# EAGLE design busfahrer_pi (EAGLE 6.4)
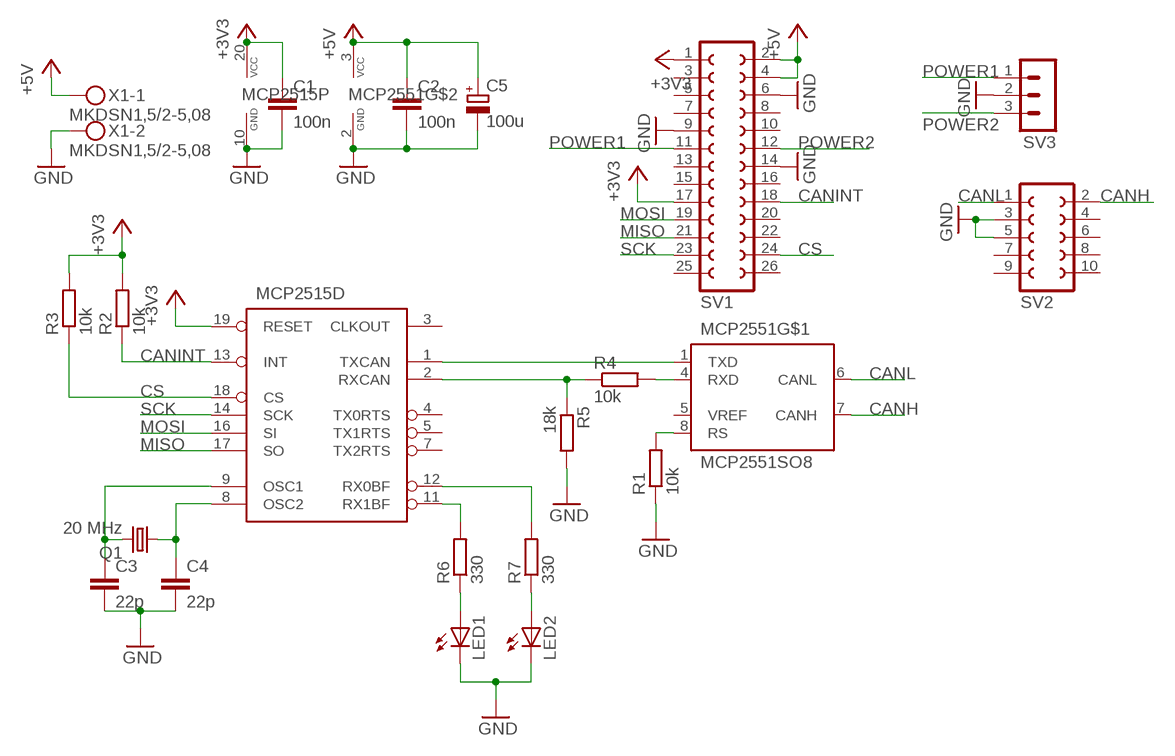
[diagram p0: schematic, sheet 1]

## Parts
C1  100n  C-EUC0805  [C0805]
C2  100n  C-EUC0805  [C0805]
C3  22p  C-EUC0805  [C0805]
C4  22p  C-EUC0805  [C0805]
C5  100u  CPOL-EUE2.5-6  [E2,5-6]
LED1  LEDCHIP-LED0805  [CHIP-LED0805]
LED2  LEDCHIP-LED0805  [CHIP-LED0805]
MCP2515  MCP2515ST  [TSSOP20]
MCP2551  MCP2551SO8  [SO08]
Q1  20 MHz  CRYSTALHC49S  [HC49/S]
R1  10k  R-EU_R0805  [R0805]
R2  10k  R-EU_R0805  [R0805]
R3  10k  R-EU_R0805  [R0805]
R4  10k  R-EU_R0805  [R0805]
R5  18k  R-EU_R0805  [R0805]
R6  330  R-EU_R0805  [R0805]
R7  330  R-EU_R0805  [R0805]
SV1  FE13-2  [FE13-2]
SV2  FE05-2  [FE05-2]
SV3  MA03-1  [MA03-1]
X1  MKDSN1,5/2-5,08  [MKDSN1,5/2-5,08]

## Nets
+3V3: C1.1 MCP2515.19(D:RESET) MCP2515.20(P:VCC) R2.2 R3.2 SV1.1 SV1.17
+5V: C2.1 C5.+ MCP2551.3(VCC) SV1.2 SV1.4 X1.1
CANH: MCP2551.7(CANH) SV2.2
CANINT: MCP2515.13(D:INT) R2.1 SV1.18
CANL: MCP2551.6(CANL) SV2.1
CS: MCP2515.18(D:CS) R3.1 SV1.24
GND: C1.2 C2.2 C3.2 C4.2 C5.- LED1.C LED2.C MCP2515.10(P:GND) MCP2551.2(GND) R1.1 R5.2 SV1.6 SV1.9 SV1.14 SV2.3 SV2.5 SV3.2 X1.2
MISO: MCP2515.17(D:SO) SV1.21
MOSI: MCP2515.16(D:SI) SV1.19
N$1: MCP2551.8(RS) R1.2
N$2: MCP2515.11(D:RX1BF) R6.2
N$3: C4.1 MCP2515.8(D:OSC2) Q1.1
N$4: C3.1 MCP2515.9(D:OSC1) Q1.2
N$8: MCP2515.12(D:RX0BF) R7.2
N$9: LED2.A R7.1
N$10: LED1.A R6.1
POWER1: SV1.11 SV3.1
POWER2: SV1.12 SV3.3
RXCAN: MCP2515.2(D:RXCAN) R4.1 R5.1
RXCAN_5V: MCP2551.4(RXD) R4.2
SCK: MCP2515.14(D:SCK) SV1.23
TXCAN: MCP2515.1(D:TXCAN) MCP2551.1(TXD)
Unconnected: MCP2515.3(D:CLKOUT) MCP2515.4(D:TX0RTS) MCP2515.5(D:TX1RTS) MCP2515.7(D:TX2RTS) MCP2551.5(VREF) SV1.3 SV1.5 SV1.7 SV1.8 SV1.10 SV1.13 SV1.15 SV1.16 SV1.20 SV1.22 SV1.25 SV1.26 SV2.4 SV2.6 SV2.7 SV2.8 SV2.9 SV2.10

## Library data of the parts
C1-C4 = rcl:C-EU: CAPACITOR, European symbol
C5 = rcl:CPOL-EU: POLARIZED CAPACITOR, European symbol
LED1 LED2 = led:LED: LED OSRAM: - CHIPLED LG R971, LG N971, LY N971, LG Q971, LY Q971, LO R971, LY R971 LH N974, LH R974 LS Q976, LO Q976, LY Q976 LO Q996 - Hyper CHIPLED LW Q18S LB Q993, LB Q99A, LB R99A - SideLED LS A670, LO A670, LY A670, LG A670, LP A670 LB A673, LV A673, LT A673, LW A673 LH A674 LY A675 LS A676, LA A676, LO A676, LY A676, LW A676 LS A679, LY A679, LG A679 - Hyper Micro SIDELED® LS Y876, LA Y876, LO Y876, LY Y876 LT Y87S - SmartLED LW L88C, LW L88S LB L89C, LB L89S, LG L890 LS L89K, LO L89K, LY L89K LS L896, LA L896, LO L896, LY L896 - TOPLED LS T670, LO T670, LY T670, LG T670, LP T670 LSG T670, LSP T670, LSY T670, LOP T670, LYG T670 LG T671, LOG T671, LSG T671 LB T673, LV T673, LT T673, LW T673 LH T674 LS T676, LA T676, LO T676, LY T676, LB T676, LH T676, LSB T676, LW T676 LB T67C, LV T67C, LT T67C, LS T67K, LO T67K, LY T67K, LW E67C LS E67B, LA E67B, LO E67B, LY E67B, LB E67C, LV E67C, LT E67C LW T67C LS T679, LY T679, LG T679 LS T770, LO T770, LY T770, LG T770, LP T770 LB T773, LV T773, LT T773, LW T773 LH T774 LS E675, LA E675, LY E675, LS T675 LS T776, LA T776, LO T776, LY T776, LB T776 LHGB T686 LT T68C, LB T68C - Hyper Mini TOPLED® LB M676 - Mini TOPLED Santana® LG M470 LS M47K, LO M47K, LY M47K Source: http://www.osram.convergy.de LUXEON: - LUMILED® LXK2-PW12-R00, LXK2-PW12-S00, LXK2-PW14-U00, LXK2-PW14-V00 LXK2-PM12-R00, LXK2-PM12-S00, LXK2-PM14-U00 LXK2-PE12-Q00, LXK2-PE12-R00, LXK2-PE12-S00, LXK2-PE14-T00, LXK2-PE14-U00 LXK2-PB12-K00, LXK2-PB12-L00, LXK2-PB12-M00, LXK2-PB14-N00, LXK2-PB14-P00, LXK2-PB14-Q00 LXK2-PR12-L00, LXK2-PR12-M00, LXK2-PR14-Q00, LXK2-PR14-R00 LXK2-PD12-Q00, LXK2-PD12-R00, LXK2-PD12-S00 LXK2-PH12-R00, LXK2-PH12-S00 LXK2-PL12-P00, LXK2-PL12-Q00, LXK2-PL12-R00 Source: www.luxeon.com KINGBRIGHT: KA-3528ASYC Source: www.kingbright.com
MCP2515 = can:MCP2515: MC2515 Stand-Alone CAN Controller With SPI Interface, Microchip
MCP2551 = can:MCP2551: CAN Tranceiver Microchip
Q1 = crystal:CRYSTAL: CRYSTAL; OC_FARNELL: 1667008; OC_NEWARK: unknown
R1-R3 R5-R7 = rcl:R-EU_: RESISTOR, European symbol
R4 = rcl_patch:R-EU_: RESISTOR, European symbol
SV1 = con-lsta:FE13-2: FEMALE HEADER; OC_FARNELL: unknown; OC_NEWARK: unknown
SV2 = con-lsta:FE05-2: FEMALE HEADER; OC_FARNELL: unknown; OC_NEWARK: unknown
SV3 = con-lstb:MA03-1: PIN HEADER; OC_FARNELL: unknown; OC_NEWARK: unknown
X1 = con-phoenix-508:MKDSN1,5/2-5,08: MKDSN 1,5/ 2-5,08 Printklemme Nennstrom: 13,5 A Nennspannung: 250 V Rastermaß: 5,08 mm Polzahl: 2 Anschlussart: Schraubanschluss Montage: Löten Anschlussrichtung Leiter/Platine: 0 ° Artikelnummer: 1729128 Source: http://eshop.phoenixcontact.com .. 1729128.pdf; MPN: MKDSN 1,5/2-5.08; OC_FARNELL: 1792903; OC_NEWARK: 30M2397

## Board
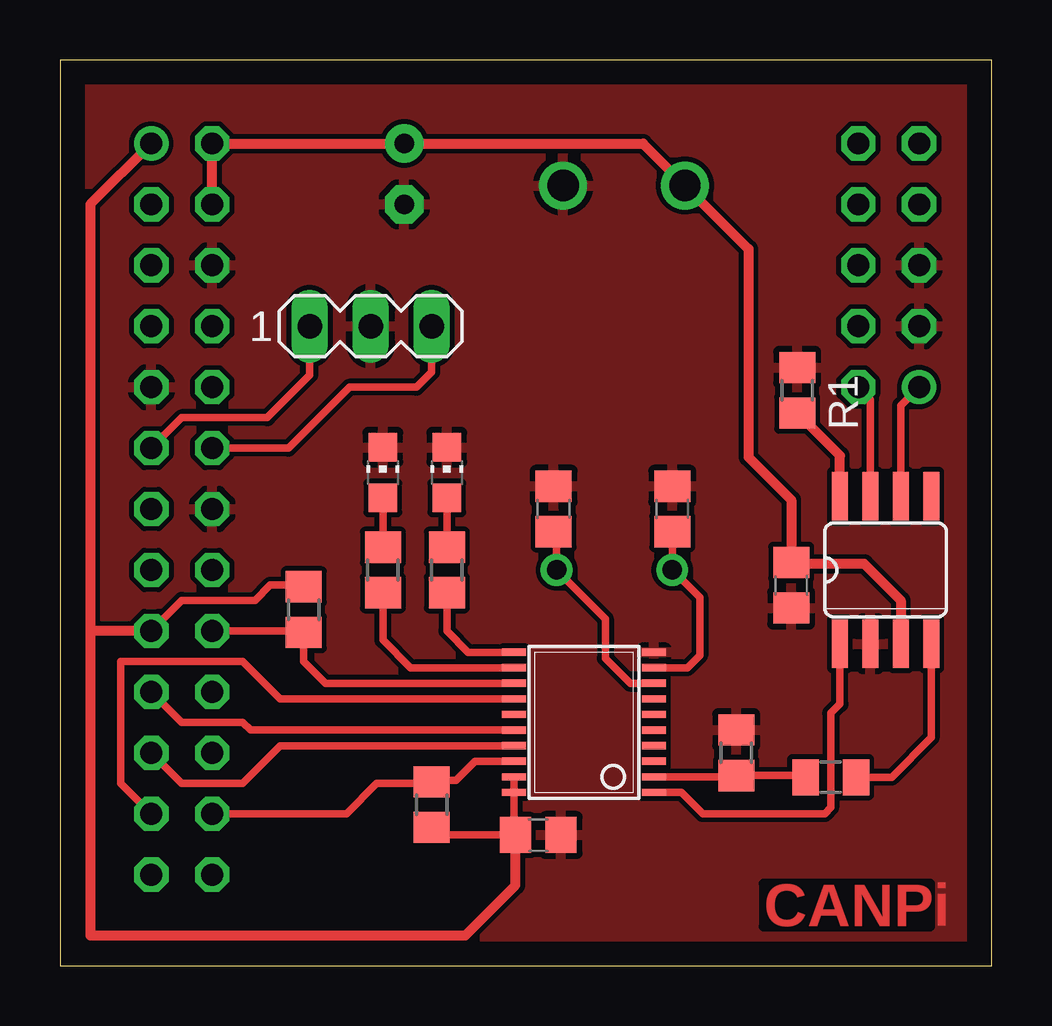
[diagram p1: board, top side]
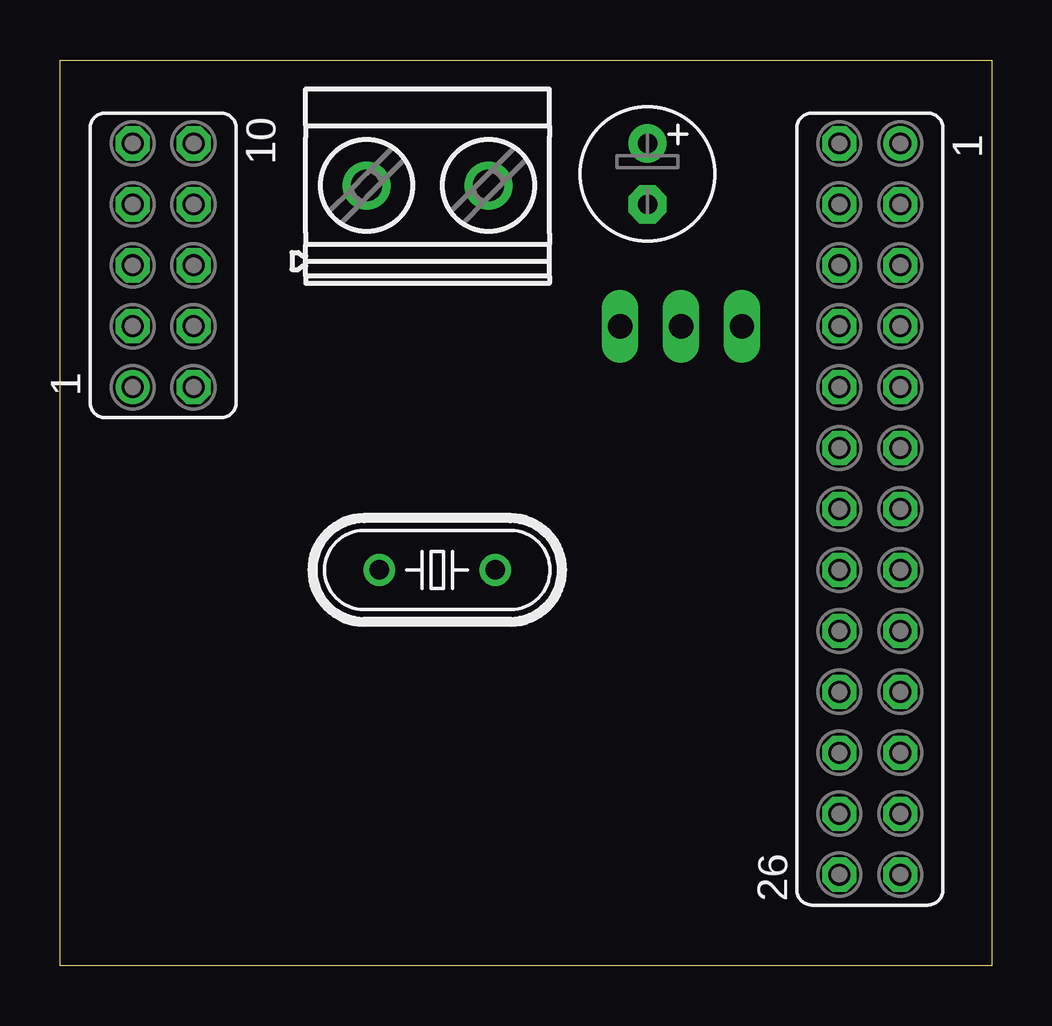
[diagram p2: board, bottom side, seen from below]

Size 38.84 x 37.77 mm. Coordinates in mm from the lower left corner, seen from the top.
Outline: 0,0 38.84,0 38.84,37.77 0,37.77 0,0
Copper layers (1*16): Top 0.035mm / dielectric 1.5mm / Bottom 0.035mm
Design rules "default": minimum track width 10mil, minimum drill 24mil, track to track 8mil, track to pad 8mil, pad to pad 8mil, via to via 8mil, smd to smd 8mil, copper to edge 40mil, drill to drill 8mil, minimum pad ring 10mil, minimum via ring 8mil, stop-mask expansion 4mil, vias tented up to drill 0mil, thermal gap 10mil

### Footprints (pad centres in the part's own frame; a part is rotated, then mirrored left to right if it is on the bottom)
C0805 = smd 1.3 x 1.5: 1 -0.95,0; 2 0.95,0
E2,5-6 = drill 0.813 pad 1.6: + -1.27,0 | drill 0.813 pad 1.6 octagon: - 1.27,0
CHIP-LED0805 = smd 1.2 x 1.2: A 0,-1.05; C 0,1.05
TSSOP20 = smd 0.305 x 0.991: 1 -2.925,-2.918; 2 -2.275,-2.918; 3 -1.625,-2.918; 4 -0.975,-2.918; 5 -0.325,-2.918; 6 0.325,-2.918; 7 0.975,-2.918; 8 1.625,-2.918; 9 2.275,-2.918; 10 2.925,-2.918; 11 2.925,2.918; 12 2.275,2.918; 13 1.625,2.918; 14 0.975,2.918; 15 0.325,2.918; 16 -0.325,2.918; 17 -0.975,2.918; 18 -1.625,2.918; 19 -2.275,2.918; 20 -2.925,2.918
SO08 = smd 0.66 x 2.032: 1 -1.905,-3.073; 2 -0.635,-3.073; 3 0.635,-3.073; 4 1.905,-3.073; 5 1.905,3.073; 6 0.635,3.073; 7 -0.635,3.073; 8 -1.905,3.073
HC49/S = drill 0.813: 1 -2.413,0; 2 2.413,0
R0805 = smd 1.3 x 1.5: 1 -0.95,0; 2 0.95,0
R0805' = smd 1.1 x 1.5: 1 -1.05,0; 2 1.05,0
FE13-2 = drill 0.914: 1 -15.24,1.27 | drill 0.914 octagon: 2 -15.24,-1.27; 3 -12.7,1.27; 4 -12.7,-1.27; 5 -10.16,1.27; 6 -10.16,-1.27; 7 -7.62,1.27; 8 -7.62,-1.27; 9 -5.08,1.27; 10 -5.08,-1.27; 11 -2.54,1.27; 12 -2.54,-1.27; 13 0,1.27; 14 0,-1.27; 15 2.54,1.27; 16 2.54,-1.27; 17 5.08,1.27; 18 5.08,-1.27; 19 7.62,1.27; 20 7.62,-1.27; 21 10.16,1.27; 22 10.16,-1.27; 23 12.7,1.27; 24 12.7,-1.27; 25 15.24,1.27; 26 15.24,-1.27
FE05-2 = drill 0.914: 1 -5.08,1.27 | drill 0.914 octagon: 2 -5.08,-1.27; 3 -2.54,1.27; 4 -2.54,-1.27; 5 0,1.27; 6 0,-1.27; 7 2.54,1.27; 8 2.54,-1.27; 9 5.08,1.27; 10 5.08,-1.27
MA03-1 = drill 1.016 long: 1 -2.54,0; 2 0,0; 3 2.54,0
MKDSN1,5/2-5,08 = drill 1.3 pad 2: 1 -2.561,0.025; 2 2.519,0.025

### Placement (x,y rotation side)
C1  19.94,5.46 0 top
C2  30.48,15.88 270 top
C3  25.53,19.05 90 top
C4  20.57,19.05 90 top
C5  14.35,33.02 270 bottom
LED1  16.13,20.57 0 top
LED2  13.46,20.57 0 top
MCP2515  21.84,10.16 90 top
MCP2551  34.42,16.51 0 top
Q1  23.11,16.51 180 bottom
R1  30.73,24 270 top
R2  10.16,14.86 90 top
R3  15.49,6.73 270 top
R4  10k  [R0805']  32.13,7.87 0 top
R5  28.19,8.89 90 top
R6  16.13,16.51 270 top
R7  13.46,16.51 270 top
SV1  5.08,19.05 270 bottom
SV2  34.54,29.21 90 bottom
SV3  12.95,26.67 0 top
X1  23.5,32.51 0 bottom

### Tracks (layer width: path | path; a pad name or v marks a point on that pad's centre or on a via)
+3V3
  Top 0.305: SV1.17 5.08,15.24 8.13,15.24 8.76,15.88 10.09,15.88 R2.2 | MCP2515.19 MCP2515.20 18.92,6.1 18.99,6.03 C1.1 15.81,5.46 R3.2
  Top 0.406: SV1.1 1.27,31.75 1.27,13.97 | 1.27,13.97 1.27,1.27 16.89,1.27 18.99,3.37 C1.1 | SV1.17 1.27,13.97
+5V
  Top 0.406: SV1.4 SV1.2 C5.+ 24.3,34.29 X1.1 28.7,29.89 28.7,21.21 30.48,19.43 C2.1 30.54,16.76 33.53,16.76 35.05,15.24 MCP2551.3
CANH
  Top 0.305: MCP2551.7 33.78,23.62 SV2.2
CANINT
  Top 0.305: SV1.18 10.1,13.97 R2.1 10.16,12.7 11.07,11.79 MCP2515.13
CANL
  Top 0.305: MCP2551.6 35.05,23.37 SV2.1
CS
  Top 0.305: MCP2515.18 17.3,8.54 16.51,7.75 15.56,7.75 R3.1 15.43,7.62 13.21,7.62 11.94,6.35 SV1.24
GND
  pour Top: -1.27,39.12 -1.27,-1.27 39.62,-1.27 39.62,39.12
MISO
  Top 0.305: MCP2515.17 9.19,9.19 7.62,7.62 5.08,7.62 SV1.21
MOSI
  Top 0.305: MCP2515.16 7.95,9.84 7.62,10.16 5.08,10.16 SV1.19
N$1
  Top 0.406: MCP2551.8 32.51,21.27 R1.2
N$2
  Top 0.305: R6.2 16.13,13.97 17.02,13.08 MCP2515.11
N$3
  Top 0.305: C4.1 20.7,17.97 Q1.1 22.73,14.48 22.73,12.83 23.77,11.79 MCP2515.8
N$4
  Top 0.305: MCP2515.9 26.15,12.44 26.67,12.95 26.67,15.37 Q1.2 C3.1
N$8
  Top 0.305: MCP2515.12 14.62,12.44 13.46,13.59 R7.2
N$9
  Top 0.305: R7.1 LED2.A
N$10
  Top 0.305: R6.1 LED1.A
POWER1
  Top 0.305: SV3.1 10.41,24.64 8.64,22.86 5.08,22.86 SV1.11
POWER2
  Top 0.305: SV3.3 15.49,24.77 14.86,24.13 12.06,24.13 9.53,21.59 SV1.12
RXCAN
  Top 0.305: MCP2515.2 28.19,7.88 R5.1 31.02,7.94 R4.1
RXCAN_5V
  Top 0.305: MCP2551.4 36.32,9.53 34.67,7.87 R4.2
SCK
  Top 0.305: MCP2515.14 9.19,11.13 7.62,12.7 2.54,12.7 2.54,7.62 SV1.23
TXCAN
  Top 0.305: MCP2515.1 25.91,7.24 26.8,6.35 31.88,6.35 32.13,6.6 32.13,10.54 32.51,10.92 MCP2551.1

### Text on the board
Top: CANPi